# Altium schematic sheet Sheet1.SchDoc
size A4
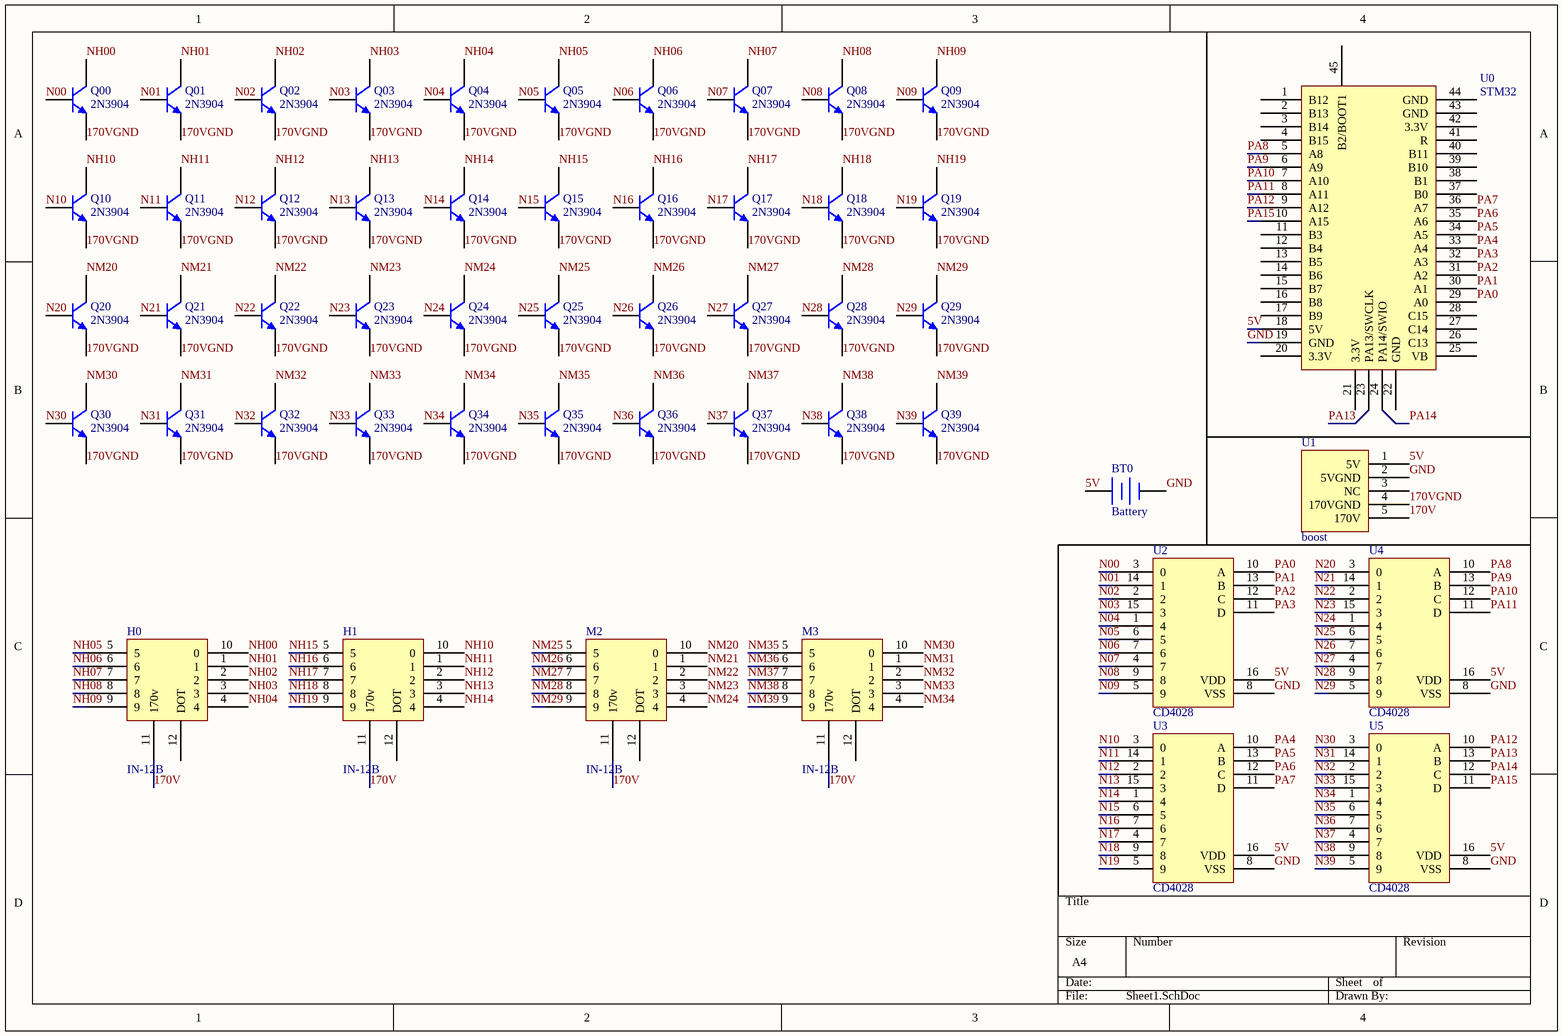
[diagram p0: Sheet1.SchDoc]

## Parts
BT0  Battery  [BAT-2]
H0  IN-12B  [IN-12B base]
H1  IN-12B  [IN-12B base]
M2  IN-12B  [IN-12B base]
M3  IN-12B  [IN-12B base]
Q00  2N3904  [TO-92]
Q01  2N3904  [TO-92]
Q02  2N3904  [TO-92]
Q03  2N3904  [TO-92]
Q04  2N3904  [TO-92]
Q05  2N3904  [TO-92]
Q06  2N3904  [TO-92]
Q07  2N3904  [TO-92]
Q08  2N3904  [TO-92]
Q09  2N3904  [TO-92]
Q10  2N3904  [TO-92]
Q11  2N3904  [TO-92]
Q12  2N3904  [TO-92]
Q13  2N3904  [TO-92]
Q14  2N3904  [TO-92]
Q15  2N3904  [TO-92]
Q16  2N3904  [TO-92]
Q17  2N3904  [TO-92]
Q18  2N3904  [TO-92]
Q19  2N3904  [TO-92]
Q20  2N3904  [TO-92]
Q21  2N3904  [TO-92]
Q22  2N3904  [TO-92]
Q23  2N3904  [TO-92]
Q24  2N3904  [TO-92]
Q25  2N3904  [TO-92]
Q26  2N3904  [TO-92]
Q27  2N3904  [TO-92]
Q28  2N3904  [TO-92]
Q29  2N3904  [TO-92]
Q30  2N3904  [TO-92]
Q31  2N3904  [TO-92]
Q32  2N3904  [TO-92]
Q33  2N3904  [TO-92]
Q34  2N3904  [TO-92]
Q35  2N3904  [TO-92]
Q36  2N3904  [TO-92]
Q37  2N3904  [TO-92]
Q38  2N3904  [TO-92]
Q39  2N3904  [TO-92]
U0  STM32  [STM32]
U1  boost  [HDR1X5]
U2  CD4028  [CD4028]
U3  CD4028  [CD4028]
U4  CD4028  [CD4028]
U5  CD4028  [CD4028]

## Nets
5V: BT0.1(+) U0.18(5V) U1.1(5V) U2.16(VDD) U3.16(VDD) U4.16(VDD) U5.16(VDD)
170V: H0.11(170v) H1.11(170v) M2.11(170v) M3.11(170v) U1.5(170V)
170VGND: Q00.1(E) Q01.1(E) Q02.1(E) Q03.1(E) Q04.1(E) Q05.1(E) Q06.1(E) Q07.1(E) Q08.1(E) Q09.1(E) Q10.1(E) Q11.1(E) Q12.1(E) Q13.1(E) Q14.1(E) Q15.1(E) Q16.1(E) Q17.1(E) Q18.1(E) Q19.1(E) Q20.1(E) Q21.1(E) Q22.1(E) Q23.1(E) Q24.1(E) Q25.1(E) Q26.1(E) Q27.1(E) Q28.1(E) Q29.1(E) Q30.1(E) Q31.1(E) Q32.1(E) Q33.1(E) Q34.1(E) Q35.1(E) Q36.1(E) Q37.1(E) Q38.1(E) Q39.1(E) U1.4(170VGND)
GND: BT0.2(-) U0.19(GND) U1.2(5VGND) U2.8(VSS) U3.8(VSS) U4.8(VSS) U5.8(VSS)
N00: Q00.2(B) U2.3(0)
N01: Q01.2(B) U2.14(1)
N02: Q02.2(B) U2.2
N03: Q03.2(B) U2.15(3)
N04: Q04.2(B) U2.1(4)
N05: Q05.2(B) U2.6(5)
N06: Q06.2(B) U2.7(6)
N07: Q07.2(B) U2.4(7)
N08: Q08.2(B) U2.9(8)
N09: Q09.2(B) U2.5(9)
N10: Q10.2(B) U3.3(0)
N11: Q11.2(B) U3.14(1)
N12: Q12.2(B) U3.2
N13: Q13.2(B) U3.15(3)
N14: Q14.2(B) U3.1(4)
N15: Q15.2(B) U3.6(5)
N16: Q16.2(B) U3.7(6)
N17: Q17.2(B) U3.4(7)
N18: Q18.2(B) U3.9(8)
N19: Q19.2(B) U3.5(9)
N20: Q20.2(B) U4.3(0)
N21: Q21.2(B) U4.14(1)
N22: Q22.2(B) U4.2
N23: Q23.2(B) U4.15(3)
N24: Q24.2(B) U4.1(4)
N25: Q25.2(B) U4.6(5)
N26: Q26.2(B) U4.7(6)
N27: Q27.2(B) U4.4(7)
N28: Q28.2(B) U4.9(8)
N29: Q29.2(B) U4.5(9)
N30: Q30.2(B) U5.3(0)
N31: Q31.2(B) U5.14(1)
N32: Q32.2(B) U5.2
N33: Q33.2(B) U5.15(3)
N34: Q34.2(B) U5.1(4)
N35: Q35.2(B) U5.6(5)
N36: Q36.2(B) U5.7(6)
N37: Q37.2(B) U5.4(7)
N38: Q38.2(B) U5.9(8)
N39: Q39.2(B) U5.5(9)
NH00: H0.10(0) Q00.3(C)
NH01: H0.1 Q01.3(C)
NH02: H0.2 Q02.3(C)
NH03: H0.3 Q03.3(C)
NH04: H0.4 Q04.3(C)
NH05: H0.5 Q05.3(C)
NH06: H0.6 Q06.3(C)
NH07: H0.7 Q07.3(C)
NH08: H0.8 Q08.3(C)
NH09: H0.9 Q09.3(C)
NH10: H1.10(0) Q10.3(C)
NH11: H1.1 Q11.3(C)
NH12: H1.2 Q12.3(C)
NH13: H1.3 Q13.3(C)
NH14: H1.4 Q14.3(C)
NH15: H1.5 Q15.3(C)
NH16: H1.6 Q16.3(C)
NH17: H1.7 Q17.3(C)
NH18: H1.8 Q18.3(C)
NH19: H1.9 Q19.3(C)
NM20: M2.10(0) Q20.3(C)
NM21: M2.1 Q21.3(C)
NM22: M2.2 Q22.3(C)
NM23: M2.3 Q23.3(C)
NM24: M2.4 Q24.3(C)
NM25: M2.5 Q25.3(C)
NM26: M2.6 Q26.3(C)
NM27: M2.7 Q27.3(C)
NM28: M2.8 Q28.3(C)
NM29: M2.9 Q29.3(C)
NM30: M3.10(0) Q30.3(C)
NM31: M3.1 Q31.3(C)
NM32: M3.2 Q32.3(C)
NM33: M3.3 Q33.3(C)
NM34: M3.4 Q34.3(C)
NM35: M3.5 Q35.3(C)
NM36: M3.6 Q36.3(C)
NM37: M3.7 Q37.3(C)
NM38: M3.8 Q38.3(C)
NM39: M3.9 Q39.3(C)
PA0: U0.29(A0) U2.10(A)
PA1: U0.30(A1) U2.13(B)
PA2: U0.31(A2) U2.12(C)
PA3: U0.32(A3) U2.11(D)
PA4: U0.33(A4) U3.10(A)
PA5: U0.34(A5) U3.13(B)
PA6: U0.35(A6) U3.12(C)
PA7: U0.36(A7) U3.11(D)
PA8: U0.5(A8) U4.10(A)
PA9: U0.6(A9) U4.13(B)
PA10: U0.7(A10) U4.12(C)
PA11: U0.8(A11) U4.11(D)
PA12: U0.9(A12) U5.10(A)
PA13: U0.23(PA13/SWCLK) U5.13(B)
PA14: U0.24(PA14/SWIO) U5.12(C)
PA15: U0.10(A15) U5.11(D)

Not connected (* = marked no-connect by the designer): H0 12(DOT); H1 12(DOT); M2 12(DOT); M3 12(DOT); U0 1(B12) 2(B13) 3(B14) 4(B15) 11(B3) 12(B4) 13(B5) 14(B6) 15(B7) 16(B8) 17(B9) 20(3.3V) 21(3.3V) 22(GND) 25(VB) 26(C13) 27(C14) 28(C15) 37(B0) 38(B1) 39(B10) 40(B11) 41(R) 42(3.3V) 43(GND) 44(GND) 45(B2/BOOT1); U1 3(NC)

## Library data of the parts
BT0 = Battery: Multicell Battery; Published: 24-Mar-1999; LatestRevisionDate: 17-Jul-2002; LatestRevisionNote: Re-released for DXP Platform.; PackageReference: BAT-2; Publisher: Altium Limited; PackageDescription: Battery; 2 Leads
Q00 Q01 Q02 Q03 Q04 Q05 Q06 Q07 Q08 Q09-Q39 = 2N3904: NPN General Purpose Amplifier; Published: 8-Jun-2000; LatestRevisionDate: 15-Jan-2003; LatestRevisionNote: PCB Footprint 'BCY-W3/D4.7' replaced; DatasheetVersion: 1997; PackageVersion: Sep-1998; PackageReference: TO-92A; Publisher: Altium Limited; PackageDescription: TO, Flat Index; 3 In-Line, Axial Leads; Body Dia. 4.5mm; Leads 0.51 x 0.48 mm (max); ComponentLink1Description: Manufacturer Link; ComponentLink1URL: http://www.fairchildsemi.com/; ComponentLink2Description: Datasheet; ComponentLink2URL: http://www.fairchildsemi.com/ds/2N%2F2N3904.pdf